# EAGLE design wheelBoard (EAGLE 6.2)
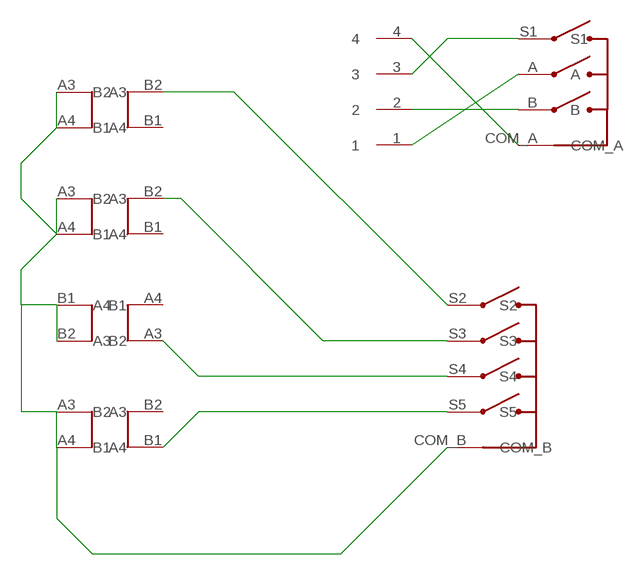
[diagram p0: schematic, sheet 1]

## Parts
U$1  TSWB-3N-CB222  [W/DIREC]
U$2  9X_TACT_PATCH  [9XTACTPADS]
U$3  9X_TACT_PATCH  [9XTACTPADS]
U$4  9X_TACT_PATCH  [9XTACTPADS]
U$5  9X_TACT_PATCH  [9XTACTPADS]
U$6  2MM_4P_HEADER  [JST2MM_4P]

## Nets
COM_A: U$1.COM_A U$6.4
COM_B: U$1.COM_B U$2.A3 U$2.A4 U$3.A3 U$3.A4 U$4.B1 U$4.B2 U$5.A3 U$5.A4
PHASE_A: U$1.A U$6.1
PHASE_B: U$1.B U$6.2
S2: U$1.S2 U$2.B2
S3: U$1.S3 U$3.B2
S4: U$1.S4 U$4.A3
S5: U$1.S5 U$5.B1
SELECT: U$1.S1 U$6.3
Unconnected: U$2.B1 U$3.B1 U$4.A4 U$5.B2

## Library data of the parts
U$1 = iksbob:TSWB-3N-CB222: Central select with jog and 4 directions
U$2-U$5 = iksbob:9X_TACT_PATCH
U$6 = iksbob:2MM_4P_HEADER

## Board
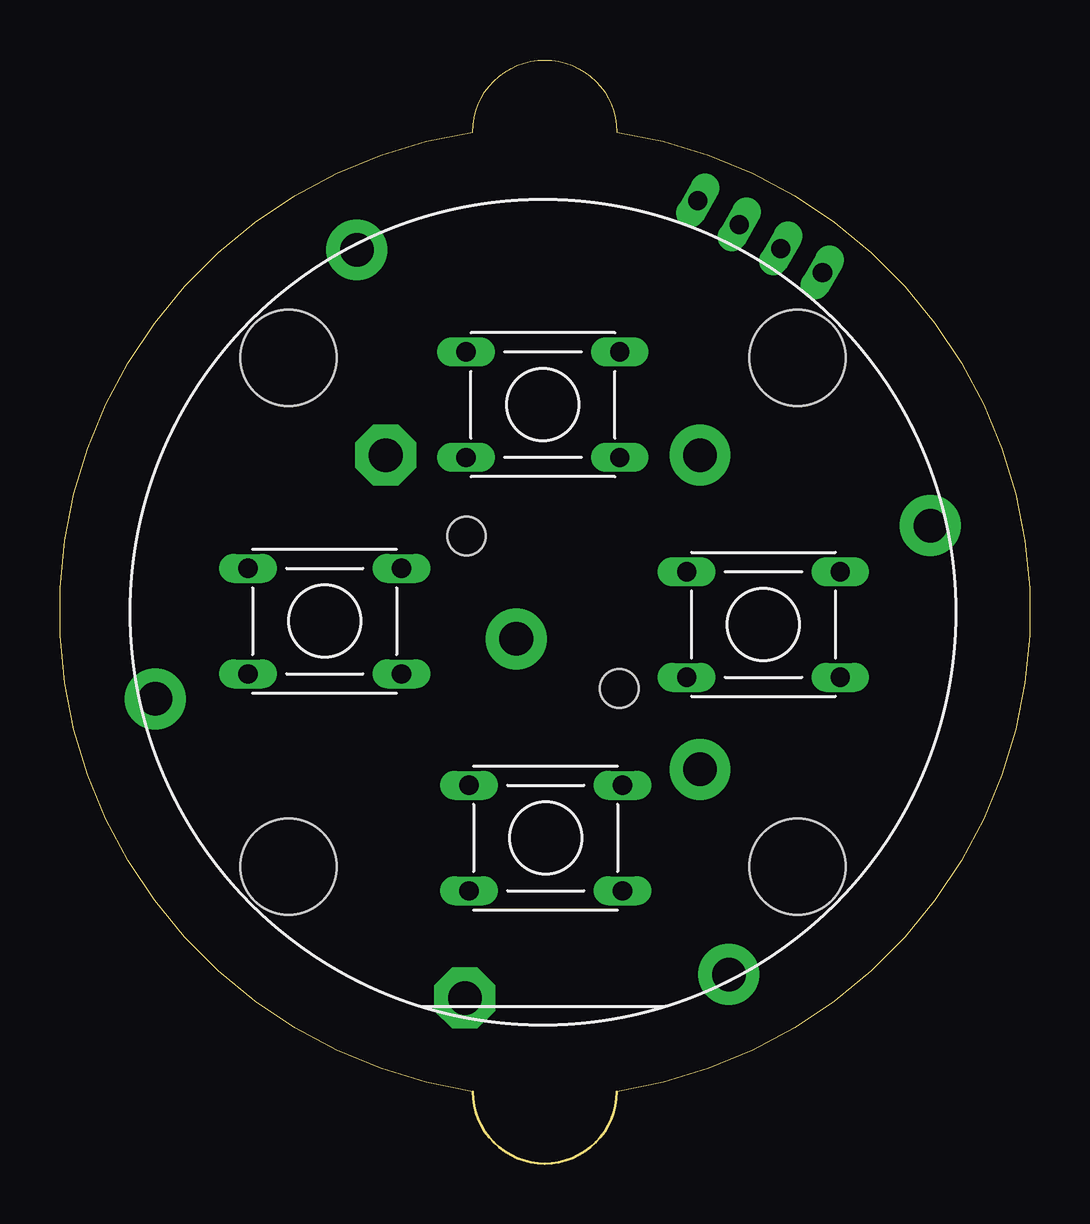
[diagram p1: board, top side]
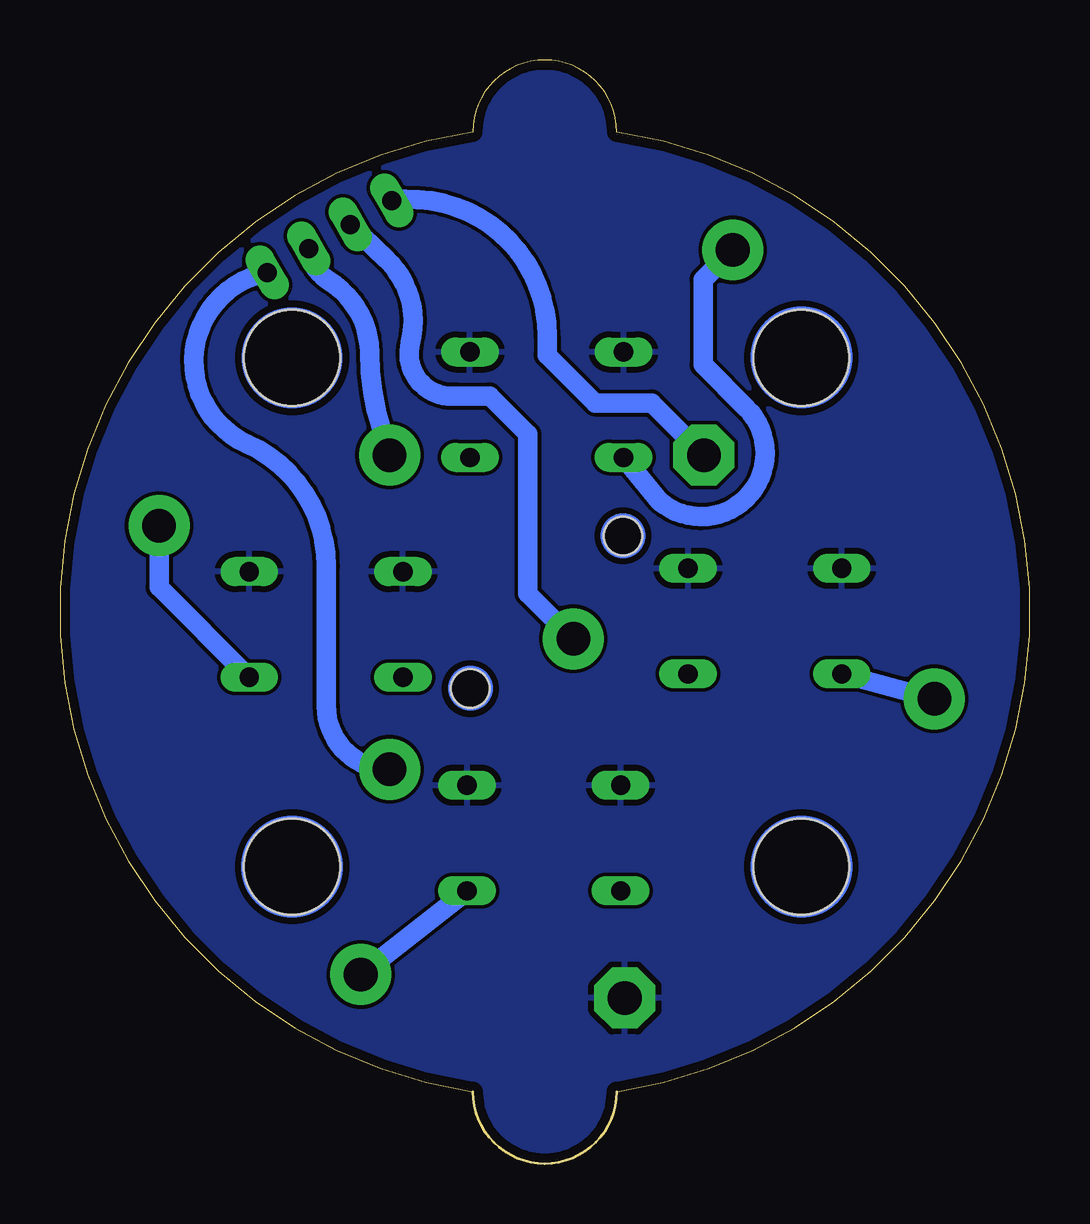
[diagram p2: board, bottom side, seen from below]

Size 40.4 x 46 mm. Coordinates in mm from the lower left corner, seen from the top.
Outline: 17.2,43 arc-180 23.2,43 arc-163 23.2,3 arc-180 17.2,3 arc-163 17.2,43
Copper layers (1*16): Top 0.0356mm / dielectric 1.5011mm / Bottom 0.0356mm
Design rules "LaenPCBOrder": minimum track width 6mil, minimum drill 13mil, track to track 6mil, track to pad 6mil, pad to pad 6mil, via to via 6mil, smd to smd 6mil, copper to edge 15mil, drill to drill 6mil, minimum pad ring 7mil, minimum via ring 7mil, stop-mask expansion 4mil, vias tented up to drill 0mil, thermal gap 10mil

### Footprints (pad centres in the part's own frame; a part is rotated, then mirrored left to right if it is on the bottom)
W/DIREC = drill 1.4 pad 2.54: A 0,-9.26; B 9.26,0; S1 -1.57,0; S2 -5.2,-16.16; S3 13.97,-8.87; S4 5.2,16.16; S5 -13.97,8.87 | drill 1.4 pad 2.54 octagon: COM_A 0,9.26; COM_B -13.67,-9.07 | hole 4: -15,0; 0,-15; 15,0; 0,15 | hole 1.6: 0,4.5; 0,-4.5
9XTACTPADS = drill 0.8 long: A3 3.2,2.2; A4 -3.2,2.2; B1 -3.2,-2.2; B2 3.2,-2.2
JST2MM_4P = drill 0.8 long: 1 0,3; 2 0,1; 3 0,-1; 4 0,-3

### Placement (x,y rotation side)
U$1  20.12,22.98 45 top
U$2  20.24,13.57 0 top
U$3  29.31,22.47 0 top
U$4  20.12,31.63 180 top
U$5  11.03,22.61 0 top
U$6  29.17,38.64 240 top

### Tracks (layer width: path | path; a pad name or v marks a point on that pad's centre or on a via)
COM_A
  Bottom 0.813: U$1.COM_A 15.74,31.7 18.1,31.7 20.1,33.7 20.1,34.5 arc-98 U$6.4
COM_B
  pour Bottom: 
  pour Bottom: -3.3,-1.3 42.9,-1.3 42.9,48.8 -3.3,48.8 -3.3,-1.1
PHASE_A
  Bottom 0.813: U$1.A arc90 29.3,19.06 29.3,24.9 arc-66 32.6,30 arc145 U$6.1
PHASE_B
  Bottom 0.813: U$1.B 27,30.6 arc17 27.5,33.8 arc-58 29.2,36.8 arc53 U$6.2
S2
  Bottom 0.813: U$1.S2 U$2.B2
S3
  Bottom 0.813: U$1.S3 36.27,24.03 U$3.B2
S4
  Bottom 0.813: U$1.S4 13.6,36.85 13.6,33.3 11.8,31.5 arc175 15.4,27.6 U$4.A3
S5
  Bottom 0.813: U$1.S5 U$5.B1
SELECT
  Bottom 0.813: U$6.3 26.8,37.7 arc61 25.8,34.2 arc-110 23.9,32 22.5,32 20.9,30.4 20.9,23.76 U$1.S1
(copper drawn outside any net)
  shapes: Bottom circle x6